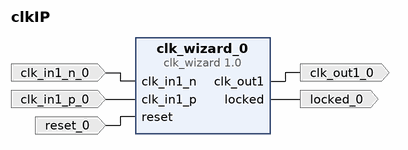
[diagram p0: block diagram of the top level]
# Vivado block design clkIP, xcvc1902-vsva2197-2MP-e-S, Vivado 2023.2
create_bd_design clkIP

create_bd_port -dir I -type rst reset_0
set_property -dict {CONFIG.POLARITY ACTIVE_HIGH} [get_bd_ports reset_0]
create_bd_port -dir I -type clk clk_in1_n_0
create_bd_port -dir I -type clk clk_in1_p_0
create_bd_port -dir O locked_0
create_bd_port -dir O -type clk clk_out1_0

create_bd_cell -type ip -vlnv xilinx.com:ip:clk_wizard:1.0 clk_wizard_0
set_property -dict [list \
  CONFIG.CLKOUT_DRIVES BUFG,BUFG,BUFG,BUFG,BUFG,BUFG,BUFG \
  CONFIG.CLKOUT_DYN_PS None,None,None,None,None,None,None \
  CONFIG.CLKOUT_GROUPING Auto,Auto,Auto,Auto,Auto,Auto,Auto \
  CONFIG.CLKOUT_MATCHED_ROUTING false,false,false,false,false,false,false \
  CONFIG.CLKOUT_PORT clk_out1,clk_out2,clk_out3,clk_out4,clk_out5,clk_out6,clk_out7 \
  CONFIG.CLKOUT_REQUESTED_DUTY_CYCLE 50.000,50.000,50.000,50.000,50.000,50.000,50.000 \
  CONFIG.CLKOUT_REQUESTED_OUT_FREQUENCY 80.0,100.000,100.000,100.000,100.000,100.000,100.000 \
  CONFIG.CLKOUT_REQUESTED_PHASE 0.000,0.000,0.000,0.000,0.000,0.000,0.000 \
  CONFIG.CLKOUT_USED true,false,false,false,false,false,false \
  CONFIG.CLK_IN1_BOARD_INTERFACE ddr4_dimm1_sma_clk \
  CONFIG.PHASESHIFT_MODE LATENCY \
  CONFIG.USE_LOCKED true \
  CONFIG.USE_RESET true \
] [get_bd_cells clk_wizard_0]

# ---- connections ----

connect_bd_net -net clk_in1_n_0_1 [get_bd_ports clk_in1_n_0] [get_bd_pins clk_wizard_0/clk_in1_n]
connect_bd_net -net clk_in1_p_0_1 [get_bd_ports clk_in1_p_0] [get_bd_pins clk_wizard_0/clk_in1_p]
connect_bd_net [get_bd_pins clk_wizard_0/clk_out1] [get_bd_ports clk_out1_0]
connect_bd_net [get_bd_pins clk_wizard_0/locked] [get_bd_ports locked_0]
connect_bd_net -net reset_0_1 [get_bd_ports reset_0] [get_bd_pins clk_wizard_0/reset]

validate_bd_design
save_bd_design
